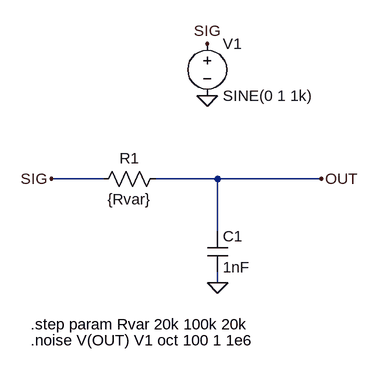
[diagram p0: schematic Noise Analysis.asc]
Noise Analysis.asc, the LTspice schematic file:
Version 4
SHEET 1 880 680
WIRE 80 144 0 144
WIRE 256 144 160 144
WIRE 416 144 256 144
WIRE 256 224 256 144
WIRE 256 304 256 288
FLAG 416 144 OUT
FLAG 0 144 SIG
FLAG 240 16 0
FLAG 240 -64 SIG
FLAG 256 304 0
SYMBOL res 176 128 R90
WINDOW 0 0 56 VBottom 2
WINDOW 3 32 56 VTop 2
SYMATTR InstName R1
SYMATTR Value {Rvar}
SYMBOL cap 240 224 R0
SYMATTR InstName C1
SYMATTR Value 1nF
SYMBOL voltage 240 -80 R0
WINDOW 123 0 0 Left 0
WINDOW 39 0 0 Left 0
SYMATTR InstName V1
SYMATTR Value SINE(0 1 1k)
TEXT -32 368 Left 2 !.step param Rvar 20k 100k 20k
TEXT -32 392 Left 2 !.noise V(OUT) V1 oct 100 1 1e6

The netlist it stands for:
* Noise Analysis.asc
R1 OUT SIG {Rvar}
C1 OUT 0 1nF
V1 SIG 0 SINE(0 1 1k)
.step param Rvar 20k 100k 20k
.noise V(OUT) V1 oct 100 1 1e6
.backanno
.end